# EAGLE design 4ch Estim Controller (EAGLE 9.3.2)
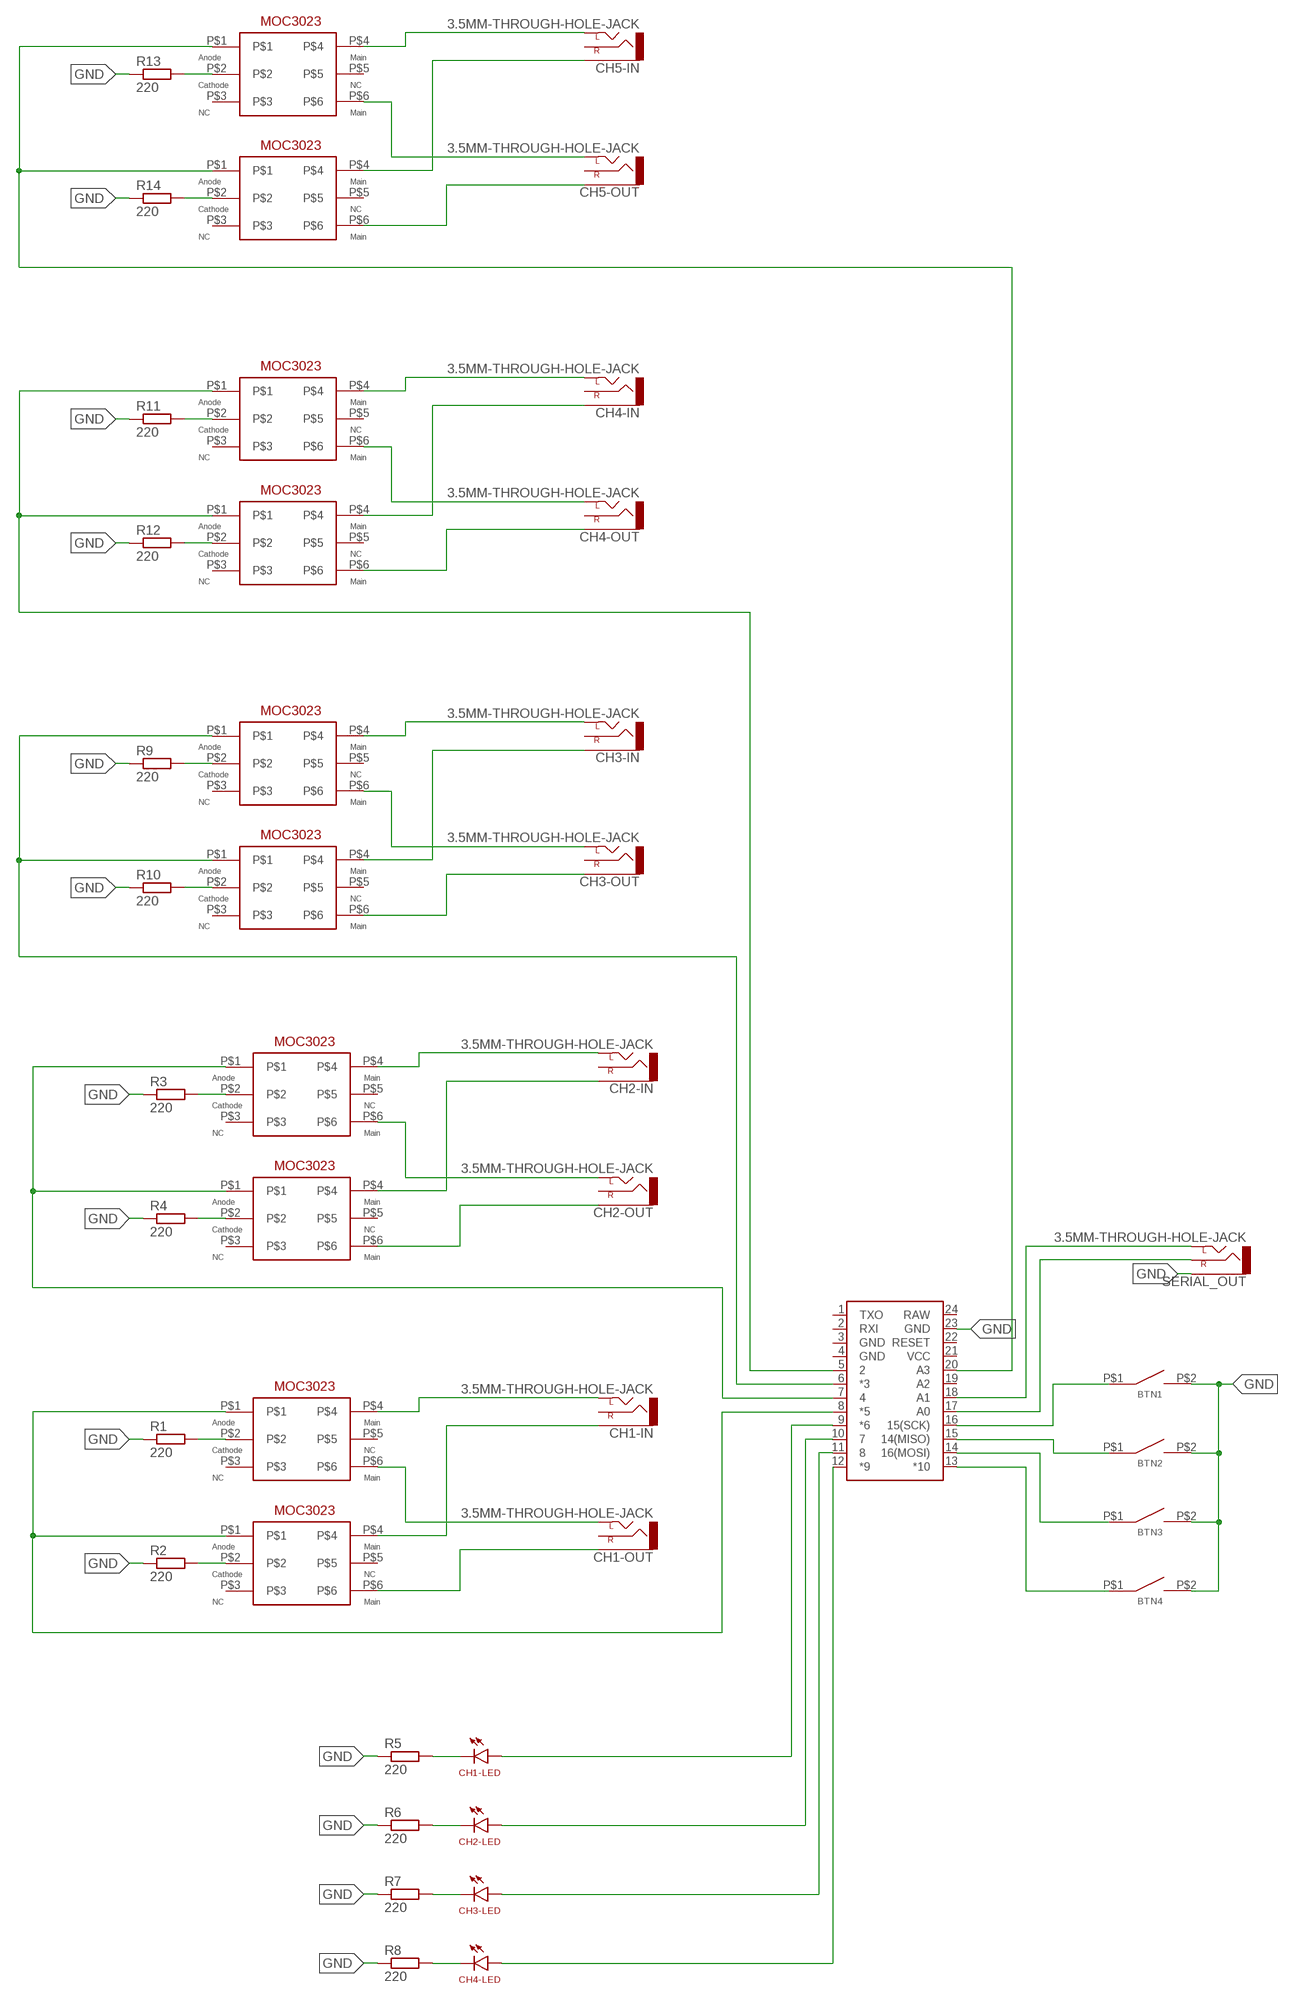
[diagram p0: schematic, sheet 1]

## Parts
B1  PRO_MICRO  [PRO_MICRO]
BTN1  THROUGH-HOLE-SWITCH  [THROUGH-HOLE-SWITCH]
BTN2  THROUGH-HOLE-SWITCH  [THROUGH-HOLE-SWITCH]
BTN3  THROUGH-HOLE-SWITCH  [THROUGH-HOLE-SWITCH]
BTN4  THROUGH-HOLE-SWITCH  [THROUGH-HOLE-SWITCH]
CH1-IN  3.5MM-THROUGH-HOLE-JACK  [THROUGH-HOLE-JACK]
CH1-LED  THROUGH-HOLE-LED  [THROUGH-HOLE-LED]
CH1-OUT  3.5MM-THROUGH-HOLE-JACK  [THROUGH-HOLE-JACK]
CH2-IN  3.5MM-THROUGH-HOLE-JACK  [THROUGH-HOLE-JACK]
CH2-LED  THROUGH-HOLE-LED  [THROUGH-HOLE-LED]
CH2-OUT  3.5MM-THROUGH-HOLE-JACK  [THROUGH-HOLE-JACK]
CH3-IN  3.5MM-THROUGH-HOLE-JACK  [THROUGH-HOLE-JACK]
CH3-LED  THROUGH-HOLE-LED  [THROUGH-HOLE-LED]
CH3-OUT  3.5MM-THROUGH-HOLE-JACK  [THROUGH-HOLE-JACK]
CH4-IN  3.5MM-THROUGH-HOLE-JACK  [THROUGH-HOLE-JACK]
CH4-LED  THROUGH-HOLE-LED  [THROUGH-HOLE-LED]
CH4-OUT  3.5MM-THROUGH-HOLE-JACK  [THROUGH-HOLE-JACK]
CH5-IN  3.5MM-THROUGH-HOLE-JACK  [THROUGH-HOLE-JACK]
CH5-OUT  3.5MM-THROUGH-HOLE-JACK  [THROUGH-HOLE-JACK]
R1  220  R-EU_0207/10  [0207/10]
R2  220  R-EU_0207/10  [0207/10]
R3  220  R-EU_0207/10  [0207/10]
R4  220  R-EU_0207/10  [0207/10]
R5  220  R-EU_0207/10  [0207/10]
R6  220  R-EU_0207/10  [0207/10]
R7  220  R-EU_0207/10  [0207/10]
R8  220  R-EU_0207/10  [0207/10]
R9  220  R-EU_0207/10  [0207/10]
R10  220  R-EU_0207/10  [0207/10]
R11  220  R-EU_0207/10  [0207/10]
R12  220  R-EU_0207/10  [0207/10]
R13  220  R-EU_0207/10  [0207/10]
R14  220  R-EU_0207/10  [0207/10]
SERIAL_OUT  3.5MM-THROUGH-HOLE-JACK  [THROUGH-HOLE-JACK]
U$1  MOC3023  [MOC3023]
U$2  MOC3023  [MOC3023]
U$3  MOC3023  [MOC3023]
U$4  MOC3023  [MOC3023]
U$9  MOC3023  [MOC3023]
U$10  MOC3023  [MOC3023]
U$11  MOC3023  [MOC3023]
U$12  MOC3023  [MOC3023]
U$13  MOC3023  [MOC3023]
U$14  MOC3023  [MOC3023]

## Nets
GND: B1.23(GND) BTN1.P$2 BTN2.P$2 BTN3.P$2 BTN4.P$2 R1.1 R2.1 R3.1 R4.1 R5.1 R6.1 R7.1 R8.1 R9.1 R10.1 R11.1 R12.1 R13.1 R14.1 SERIAL_OUT.P$3(SLEEVE)
N$1: B1.13(*10) BTN4.P$1
N$2: B1.14(16(MOSI)) BTN3.P$1
N$3: B1.15(14(MISO)) BTN2.P$1
N$4: B1.16(15(SCK)) BTN1.P$1
N$5: CH1-IN.P$1(LEFT) U$3.P$4
N$6: CH1-LED.P$2(C) R5.2
N$7: CH2-LED.P$2(C) R6.2
N$8: CH3-LED.P$2(C) R7.2
N$9: CH4-LED.P$2(C) R8.2
N$10: B1.12(*9) CH4-LED.P$1(A)
N$11: B1.11 CH3-LED.P$1(A)
N$12: B1.10 CH2-LED.P$1(A)
N$13: B1.9(*6) CH1-LED.P$1(A)
N$14: CH1-IN.P$3(SLEEVE) U$4.P$4
N$15: R2.2 U$4.P$2
N$16: R1.2 U$3.P$2
N$17: B1.8(*5) U$3.P$1 U$4.P$1
N$18: CH1-OUT.P$1(LEFT) U$3.P$6
N$19: CH1-OUT.P$3(SLEEVE) U$4.P$6
N$20: CH2-IN.P$1(LEFT) U$1.P$4
N$21: CH2-IN.P$3(SLEEVE) U$2.P$4
N$22: CH2-OUT.P$1(LEFT) U$1.P$6
N$23: B1.17(A0) SERIAL_OUT.P$2(RIGHT)
N$24: B1.18(A1) SERIAL_OUT.P$1(LEFT)
N$25: CH2-OUT.P$3(SLEEVE) U$2.P$6
N$26: B1.7 U$1.P$1 U$2.P$1
N$27: R4.2 U$2.P$2
N$28: R3.2 U$1.P$2
N$29: CH3-IN.P$1(LEFT) U$9.P$4
N$30: CH3-IN.P$3(SLEEVE) U$10.P$4
N$31: CH3-OUT.P$1(LEFT) U$9.P$6
N$32: CH3-OUT.P$3(SLEEVE) U$10.P$6
N$33: B1.6(*3) U$9.P$1 U$10.P$1
N$34: R9.2 U$9.P$2
N$35: R10.2 U$10.P$2
N$36: CH4-IN.P$1(LEFT) U$11.P$4
N$37: CH4-IN.P$3(SLEEVE) U$12.P$4
N$38: CH4-OUT.P$1(LEFT) U$11.P$6
N$39: CH4-OUT.P$3(SLEEVE) U$12.P$6
N$40: B1.5 U$11.P$1 U$12.P$1
N$41: R11.2 U$11.P$2
N$42: R12.2 U$12.P$2
N$43: CH5-IN.P$1(LEFT) U$13.P$4
N$44: CH5-IN.P$3(SLEEVE) U$14.P$4
N$45: CH5-OUT.P$1(LEFT) U$13.P$6
N$46: CH5-OUT.P$3(SLEEVE) U$14.P$6
N$47: R13.2 U$13.P$2
N$48: R14.2 U$14.P$2
N$50: B1.20(A3) U$13.P$1 U$14.P$1
Unconnected: B1.1(TXO) B1.2(RXI) B1.19(A2) B1.22(RESET) CH1-IN.P$2(RIGHT) CH1-OUT.P$2(RIGHT) CH2-IN.P$2(RIGHT) CH2-OUT.P$2(RIGHT) CH3-IN.P$2(RIGHT) CH3-OUT.P$2(RIGHT) CH4-IN.P$2(RIGHT) CH4-OUT.P$2(RIGHT) CH5-IN.P$2(RIGHT) CH5-OUT.P$2(RIGHT) U$1.P$3 U$1.P$5 U$2.P$3 U$2.P$5 U$3.P$3 U$3.P$5 U$4.P$3 U$4.P$5 U$9.P$3 U$9.P$5 U$10.P$3 U$10.P$5 U$11.P$3 U$11.P$5 U$12.P$3 U$12.P$5 U$13.P$3 U$13.P$5 U$14.P$3 U$14.P$5

## Power pins joined to a net without a drawn wire
GND: B1.3(GND) B1.4(GND)
RAW: B1.24(RAW)
VCC: B1.21(VCC)

## Library data of the parts
B1 = Me:PRO_MICRO: SparkFun Pro Micro Atmega32U4 compatible footprint. SparkFun Products: 3.3V/8MHz <https://www.sparkfun.com/products/12587> 5V/16MHz <https://www.sparkfun.com/products/12640>
BTN1-BTN4 = Me:THROUGH-HOLE-SWITCH
CH1-IN CH1-OUT CH2-IN CH2-OUT CH3-IN CH3-OUT CH4-IN CH4-OUT CH5-IN CH5-OUT SERIAL_OUT = Me:3.5MM-THROUGH-HOLE-JACK
CH1-LED CH2-LED CH3-LED CH4-LED = Me:THROUGH-HOLE-LED
R1-R14 = rcl:R-EU_: RESISTOR, European symbol; SPICEPREFIX: R
U$1-U$4 U$9-U$14 = Me:MOC3023

## Board
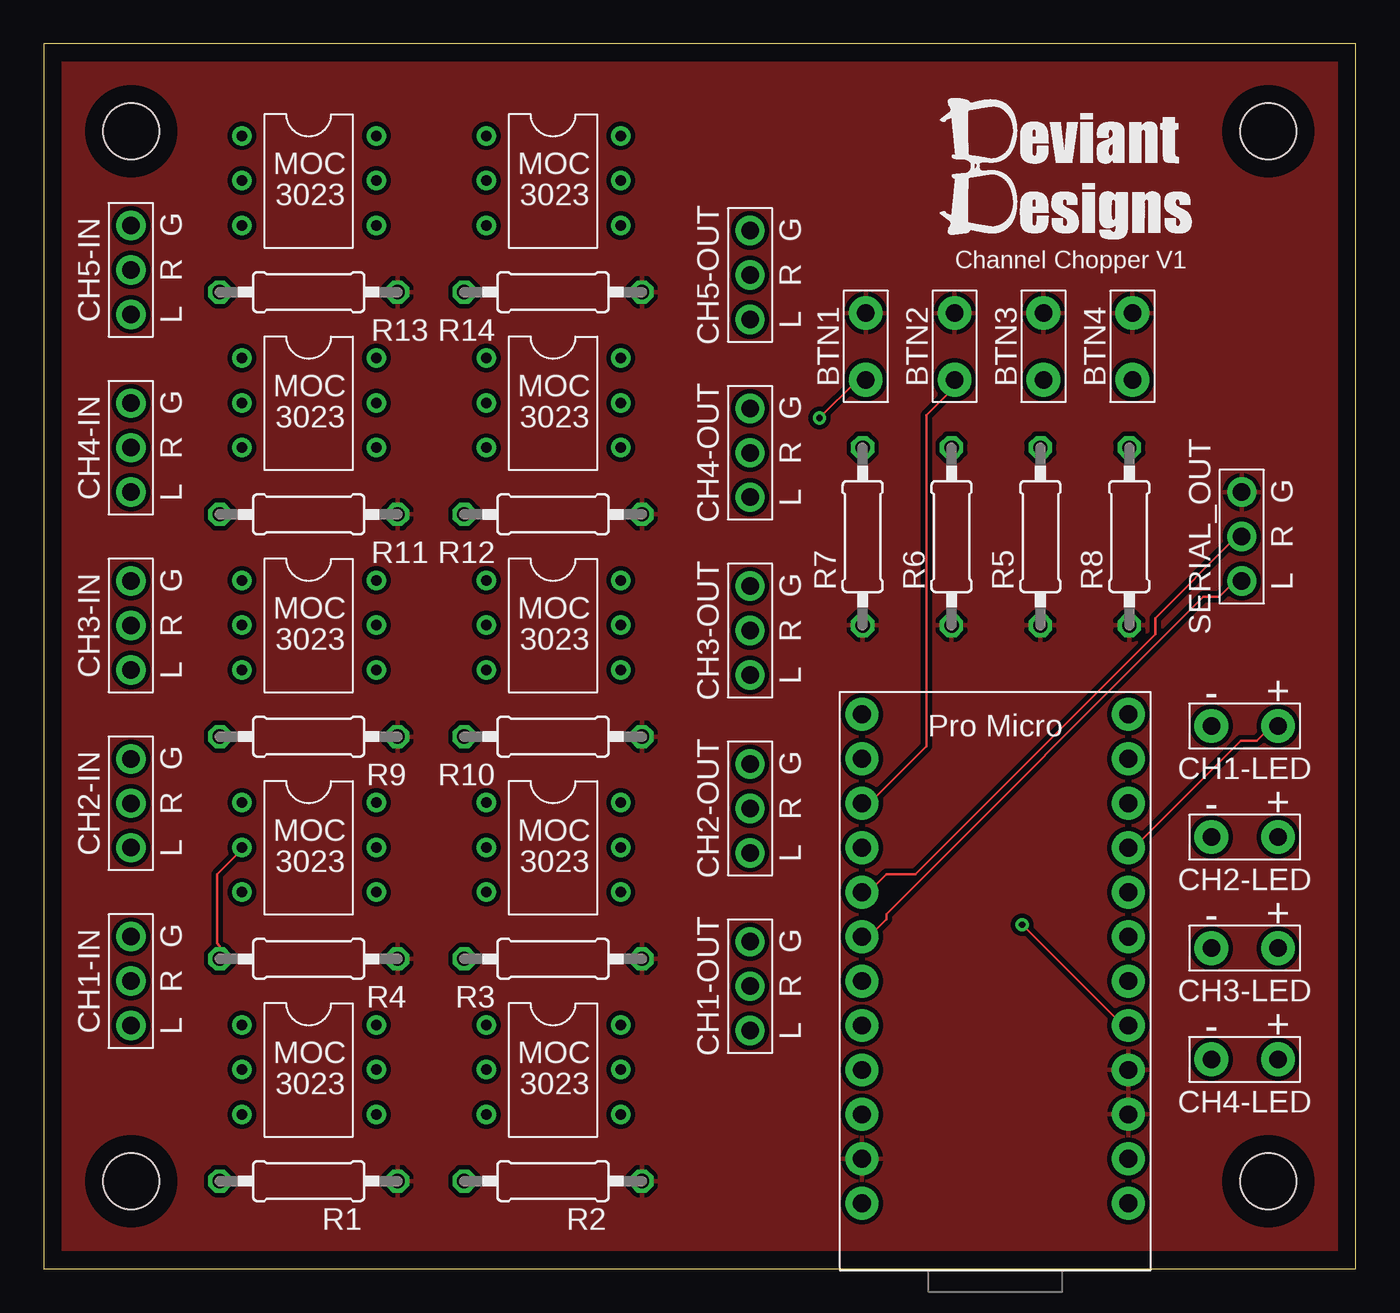
[diagram p1: board, top side]
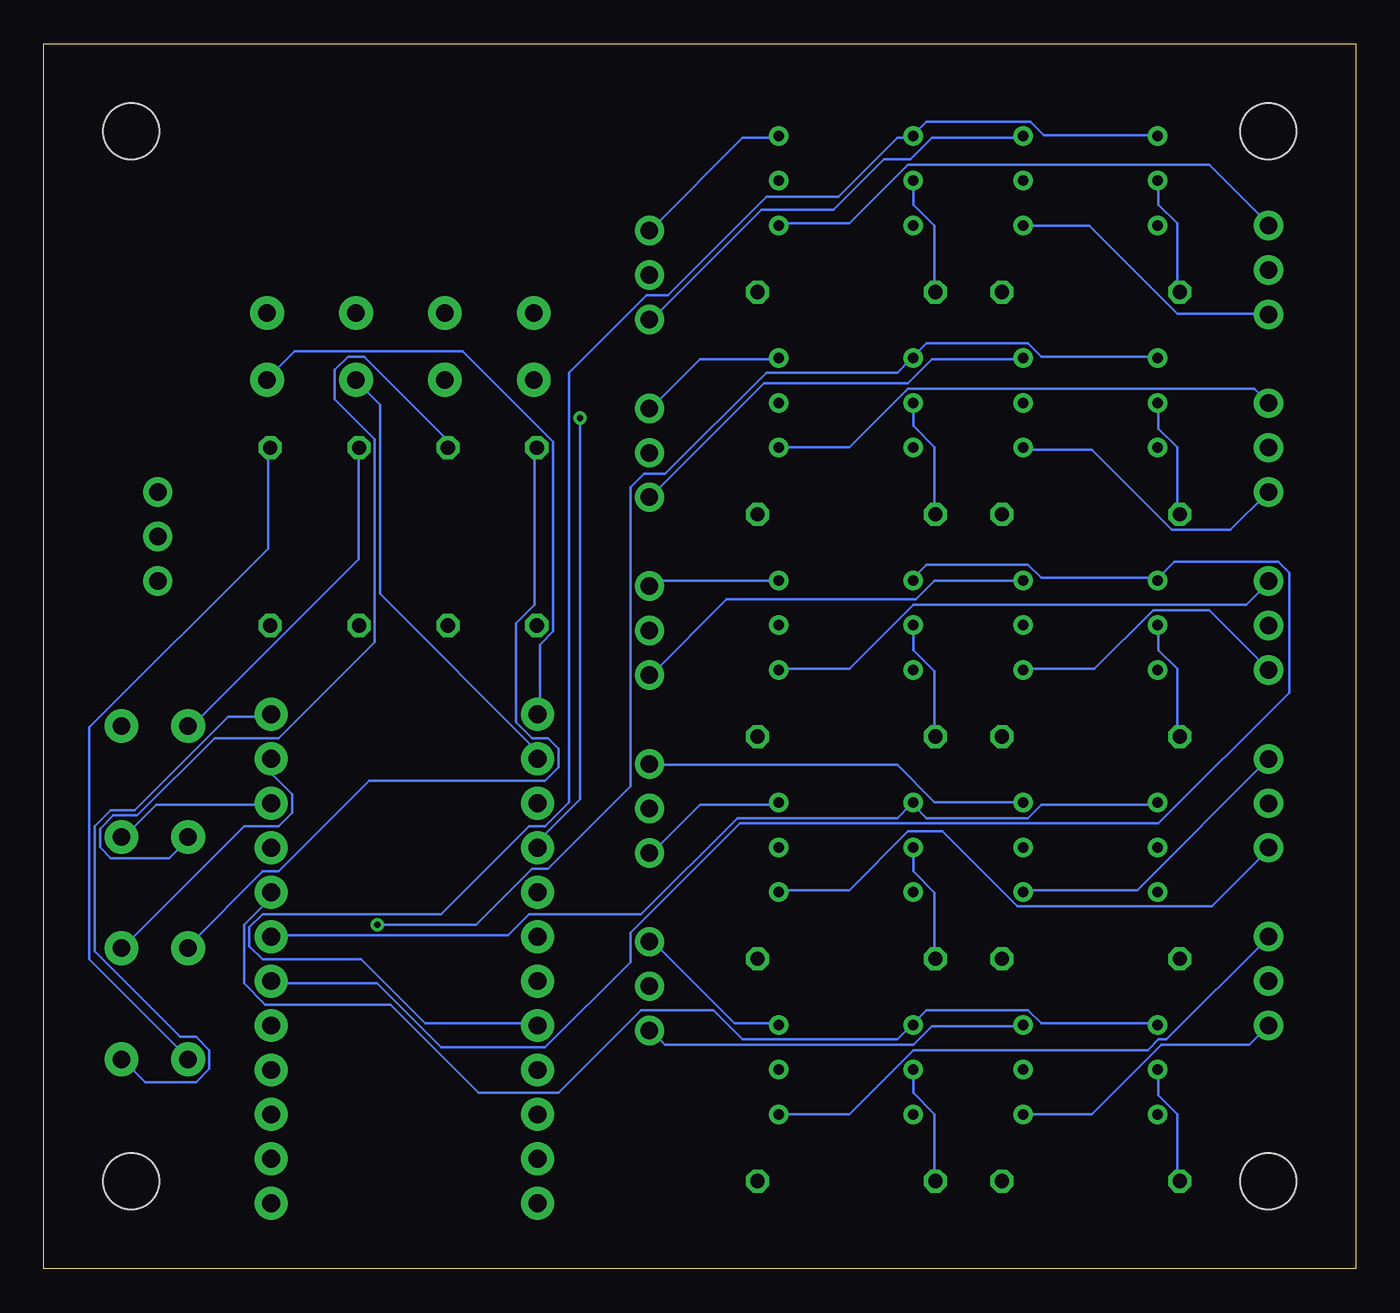
[diagram p2: board, bottom side, seen from below]

Size 75 x 70 mm. Coordinates in mm from the lower left corner, seen from the top.
Outline: 0,0 75,0 75,70 0,70 0,0
Copper layers (1*16): Top 0.035mm / dielectric 1.5mm / Bottom 0.035mm
Design rules "default": minimum track width 6mil, minimum drill 0.35mm, track to track 6mil, track to pad 6mil, pad to pad 6mil, via to via 6mil, smd to smd 6mil, copper to edge 40mil, drill to drill 6mil, minimum pad ring 10mil, minimum via ring 8mil, stop-mask expansion 4mil, vias tented up to drill 0mil, thermal gap 10mil
Holes 3.2 mm at 5,65 5,5 70,5 70,65

### Footprints (pad centres in the part's own frame; a part is rotated, then mirrored left to right if it is on the bottom)
PRO_MICRO = drill 1.016 pad 1.88: 1 -7.62,12.7; 2 -7.62,10.16; 3 -7.62,7.62; 4 -7.62,5.08; 5 -7.62,2.54; 6 -7.62,0; 7 -7.62,-2.54; 8 -7.62,-5.08; 9 -7.62,-7.62; 10 -7.62,-10.16; 11 -7.62,-12.7; 12 -7.62,-15.24; 13 7.62,-15.24; 14 7.62,-12.7; 15 7.62,-10.16; 16 7.62,-7.62; 17 7.62,-5.08; 18 7.62,-2.54; 19 7.62,0; 20 7.62,2.54; 21 7.62,5.08; 22 7.62,7.62; 23 7.62,10.16; 24 7.62,12.7
THROUGH-HOLE-SWITCH = drill 1 pad 1.93: P$1 0,0; P$2 3.81,0
THROUGH-HOLE-JACK = drill 1 pad 1.676: P$1 0,0; P$2 2.54,0; P$3 5.08,0
THROUGH-HOLE-LED = drill 1 pad 1.93: P$1 0,0; P$2 3.81,0
0207/10 = drill 0.813 octagon: 1 -5.08,0; 2 5.08,0
MOC3023 = drill 0.6: P$1 0,5.12; P$2 0,2.56; P$3 0,0; P$4 7.68,0; P$5 7.68,2.56; P$6 7.68,5.12

### Placement (x,y rotation side)
B1  54.39,16.44 180 top
BTN1  46.99,50.8 90 top
BTN2  52.07,50.8 90 top
BTN3  57.15,50.8 90 top
BTN4  62.23,50.8 90 top
CH1-IN  4.98,13.9 90 top
CH1-LED  70.56,31.02 180 top
CH1-OUT  40.38,13.61 90 top
CH2-IN  4.98,24.06 90 top
CH2-LED  70.56,24.67 180 top
CH2-OUT  40.38,23.77 90 top
CH3-IN  4.98,34.22 90 top
CH3-LED  70.56,18.32 180 top
CH3-OUT  40.38,33.93 90 top
CH4-IN  4.98,44.38 90 top
CH4-LED  70.56,11.97 180 top
CH4-OUT  40.38,44.09 90 top
CH5-IN  4.98,54.54 90 top
CH5-OUT  40.38,54.25 90 top
R1  15.14,5.01 180 top
R2  29.11,5.01 180 top
R3  29.11,17.71 180 top
R4  15.14,17.71 180 top
R5  56.97,41.84 90 top
R6  51.89,41.84 90 top
R7  46.81,41.84 90 top
R8  62.05,41.84 90 top
R9  15.14,30.41 180 top
R10  29.11,30.41 180 top
R11  15.14,43.11 180 top
R12  29.11,43.11 180 top
R13  15.14,55.81 180 top
R14  29.11,55.81 180 top
SERIAL_OUT  68.48,39.3 90 top
U$1  25.3,21.52 0 top
U$2  11.33,21.52 0 top
U$3  11.33,8.82 0 top
U$4  25.3,8.82 0 top
U$9  11.33,34.22 0 top
U$10  25.3,34.22 0 top
U$11  11.33,46.92 0 top
U$12  25.3,46.92 0 top
U$13  11.33,59.62 0 top
U$14  25.3,59.62 0 top
U$15  [LOGO_DD_10MM_HIGH]  58.42,62.23 0 top

### Tracks (layer width: path | path; a pad name or v marks a point on that pad's centre or on a via)
GND
  pour Top (isolate 0.254): 0,0 75,0 75,70 0,70
N$1
  Bottom 0.152: B1.13 46.63,31.7 46.63,35.66 45.87,36.42 45.87,47.24 51.05,52.43 60.66,52.43 62.18,50.9 BTN4.P$1
N$2
  Bottom 0.152: B1.14 46.79,29.26 46.79,29.57 55.78,38.56 55.78,49.38 57.15,50.75 BTN3.P$1
N$3
  Top 0.152: B1.15 46.79,26.67 47.24,26.67 50.44,29.87 50.44,48.77 51.97,50.29 51.97,50.75 BTN2.P$1
N$4  (via drill 0.35)
  Top 0.152: v44.35,48.62 46.48,50.75 46.94,50.75 BTN1.P$1
  Bottom 0.152: v44.35,48.62 44.35,26.82 46.63,24.54 46.63,24.08 B1.16
N$5
  Bottom 0.152: U$3.P$4 18.9,8.84 15.09,8.84 11.12,12.8 6.1,12.8 5.03,13.87 CH1-IN.P$1
N$6
  Bottom 0.152: R5.2 57,46.79 57,40.54 66.6,30.94 CH1-LED.P$2
N$7
  Bottom 0.152: R6.2 51.97,46.94 51.97,47.4 56.69,52.12 57.61,52.12 58.37,51.36 58.37,49.68 56.08,47.4 56.08,35.81 61.57,30.33 65.23,30.33 69.65,25.91 71.02,25.91 71.78,25.15 71.78,24.08 71.17,23.47 67.82,23.47 66.75,24.54 CH2-LED.P$2
N$8
  Bottom 0.152: R7.2 46.94,46.79 46.94,37.95 48.01,36.88 48.01,31.24 47.09,30.33 46.18,30.33 45.57,29.72 45.57,28.65 46.33,27.89 56.39,27.89 61.57,22.71 62.48,22.71 66.75,18.44 CH3-LED.P$2
N$9
  Bottom 0.152: R8.2 62.18,46.79 62.18,41.15 72.39,30.94 72.39,17.68 66.75,12.04 CH4-LED.P$2
N$10
  Bottom 0.152: B1.12 62.03,31.55 64.47,31.55 69.8,26.21 71.17,26.21 72.08,25.3 72.08,18.14 67.21,13.26 66.29,13.26 65.53,12.5 65.53,11.43 66.29,10.67 69.19,10.67 70.41,11.89 CH4-LED.P$1
N$11
  Bottom 0.152: B1.11 61.87,29.11 61.87,28.19 60.81,27.13 60.81,26.06 61.57,25.3 63.55,25.3 70.41,18.44 CH3-LED.P$1
N$12
  Bottom 0.152: B1.10 62.03,26.52 68.58,26.52 70.41,24.69 CH2-LED.P$1
N$13
  Top 0.152: B1.9 62.03,24.08 62.33,24.08 68.43,30.18 69.34,30.18 70.1,30.94 70.41,30.94 CH1-LED.P$1
N$14
  Bottom 0.152: U$4.P$4 32.92,8.84 28.96,8.84 25.3,12.5 11.89,12.5 11.28,13.11 10.82,13.11 5.03,18.9 CH1-IN.P$3
N$15
  Bottom 0.152: U$4.P$2 25.3,11.28 25.3,10.06 24.08,8.84 24.08,5.03 R2.2
N$16
  Bottom 0.152: U$3.P$2 11.28,11.28 11.28,9.91 10.21,8.84 10.21,5.03 R1.2
N$17
  Bottom 0.152: U$3.P$1 11.43,14.02 17.98,14.02 18.75,14.78 24.54,14.78 25.3,14.02 U$4.P$1 25.45,13.87 26.21,13.11 35.05,13.11 36.73,14.78 40.84,14.78 45.57,10.06 50.14,10.06 55.17,15.09 62.33,15.09 63.55,16.31 63.55,19.66 62.03,21.18 62.03,21.49 B1.8
N$18
  Bottom 0.152: U$3.P$6 19.05,13.87 24.23,13.87 25.3,12.8 39.47,12.8 40.23,13.56 CH1-OUT.P$1
N$19
  Bottom 0.152: U$4.P$6 33.07,14.02 35.51,14.02 40.23,18.75 CH1-OUT.P$3
N$20
  Bottom 0.152: U$1.P$4 32.92,21.64 28.96,21.64 25.6,24.99 23.62,24.99 19.36,20.73 8.23,20.73 5.03,23.93 CH2-IN.P$1
N$21
  Bottom 0.152: U$2.P$4 18.9,21.64 12.5,21.64 5.03,29.11 CH2-IN.P$3
N$22
  Bottom 0.152: U$1.P$6 33.07,26.52 37.49,26.52 40.23,23.77 CH2-OUT.P$1
N$23
  Top 0.152: SERIAL_OUT.P$2 68.43,41.76 68.12,41.76 63.55,37.19 63.55,36.27 49.84,22.55 48.16,22.55 47.24,21.64 46.79,21.64 B1.17
N$24
  Top 0.152: SERIAL_OUT.P$1 68.43,39.17 67.97,39.17 67.21,38.41 66.29,38.41 48.16,20.27 48.16,19.96 47.24,19.05 46.79,19.05 B1.18
N$25
  Bottom 0.152: U$2.P$6 19.05,26.67 24.08,26.67 26.21,28.8 40.23,28.8 CH2-OUT.P$3
N$26
  Bottom 0.152: U$2.P$1 11.43,26.52 17.98,26.52 18.75,25.76 24.54,25.76 25.3,26.52 U$1.P$1 25.45,26.52 26.21,25.76 35.36,25.76 40.84,20.27 47.24,20.27 48.46,19.05 61.87,19.05 B1.7
N$27
  Top 0.152: U$2.P$2 11.28,23.93 9.91,22.55 9.91,18.59 10.06,18.44 10.06,17.83 R4.2
N$28
  Bottom 0.152: U$1.P$2 25.3,23.93 25.3,22.71 24.08,21.49 24.08,17.83 R3.2
N$29
  Bottom 0.152: U$9.P$4 18.9,34.29 14.94,34.29 11.58,37.64 8.38,37.64 5.03,34.29 CH3-IN.P$1
N$30
  Bottom 0.152: U$10.P$4 32.92,34.29 28.96,34.29 25.3,37.95 6.25,37.95 5.03,39.17 CH3-IN.P$3
N$31
  Bottom 0.152: U$9.P$6 19.05,39.32 24.08,39.32 25.15,38.25 35.97,38.25 40.23,33.98 CH3-OUT.P$1
N$32
  Bottom 0.152: U$10.P$6 33.07,39.32 39.93,39.32 40.23,39.01 CH3-OUT.P$3
N$33
  Bottom 0.152: U$10.P$1 25.3,39.47 24.54,40.23 18.75,40.23 17.98,39.47 11.43,39.47 U$9.P$1 11.28,39.47 10.36,40.39 4.42,40.39 3.81,39.78 3.81,32.92 11.28,25.45 35.2,25.45 41.45,19.2 41.45,17.53 46.33,12.65 52.27,12.65 55.93,16.31 61.87,16.31 B1.6
N$34
  Bottom 0.152: U$9.P$2 11.28,36.73 11.28,35.36 10.21,34.29 10.21,30.48 R9.2
N$35
  Bottom 0.152: U$10.P$2 25.3,36.73 25.3,35.36 24.08,34.14 24.08,30.48 R10.2
N$36
  Bottom 0.152: U$11.P$4 18.9,46.79 15.09,46.79 10.52,42.22 7.16,42.22 5.03,44.35 CH4-IN.P$1
N$37
  Bottom 0.152: U$12.P$4 32.92,46.94 28.96,46.94 25.6,50.29 5.79,50.29 5.03,49.53 CH4-IN.P$3
N$38
  Bottom 0.152: U$11.P$6 19.05,51.97 24.23,51.97 25.6,50.6 33.83,50.6 40.23,44.2 CH4-OUT.P$1
N$39
  Bottom 0.152: U$12.P$6 33.07,51.97 37.49,51.97 40.23,49.23 CH4-OUT.P$3
N$40  (via drill 0.35)
  Top 0.152: v55.93,19.66 61.57,14.02 61.87,14.02 B1.5
  Bottom 0.152: U$11.P$1 11.43,52.12 17.98,52.12 18.75,52.88 24.54,52.88 25.3,52.12 U$12.P$1 25.45,51.97 26.21,51.21 33.68,51.21 39.47,45.41 40.69,45.41 41.45,44.65 41.45,27.58 46.18,22.86 47.09,22.86 50.29,19.66 v55.93,19.66
N$41
  Bottom 0.152: U$11.P$2 11.28,49.38 11.28,48.01 10.21,46.94 10.21,43.13 R11.2
N$42
  Bottom 0.152: U$12.P$2 25.3,49.38 25.3,48.16 24.08,46.94 24.08,43.13 R12.2
N$43
  Bottom 0.152: U$13.P$4 18.9,59.59 15.24,59.59 10.21,54.56 5.03,54.56 CH5-IN.P$1
N$44
  Bottom 0.152: U$14.P$4 32.92,59.74 28.96,59.74 25.6,63.09 8.38,63.09 5.03,59.74 CH5-IN.P$3
N$45
  Bottom 0.152: U$13.P$6 19.05,64.62 24.23,64.62 25.45,63.4 26.98,63.4 29.87,60.5 33.98,60.5 40.23,54.25 CH5-OUT.P$1
N$46
  Bottom 0.152: U$14.P$6 33.07,64.62 35.05,64.62 40.23,59.44 CH5-OUT.P$3
N$47
  Bottom 0.152: U$13.P$2 11.28,62.03 11.28,60.81 10.21,59.74 10.21,55.93 R13.2
N$48
  Bottom 0.152: U$14.P$2 25.3,62.03 25.3,60.81 24.08,59.59 24.08,55.93 R14.2
N$50
  Bottom 0.152: U$13.P$1 11.43,64.77 17.83,64.77 18.59,65.53 24.54,65.53 25.3,64.77 U$14.P$1 25.45,64.62 26.21,64.62 29.57,61.27 33.68,61.27 39.32,55.63 40.54,55.63 44.96,51.21 44.96,26.67 46.33,25.3 47.24,25.3 52.27,20.27 62.48,20.27 63.25,19.51 63.25,18.44 62.48,17.68 56.84,17.68 53.19,14.02 46.79,14.02 B1.20

### Text on the board
tPlace: Channel Chopper V1